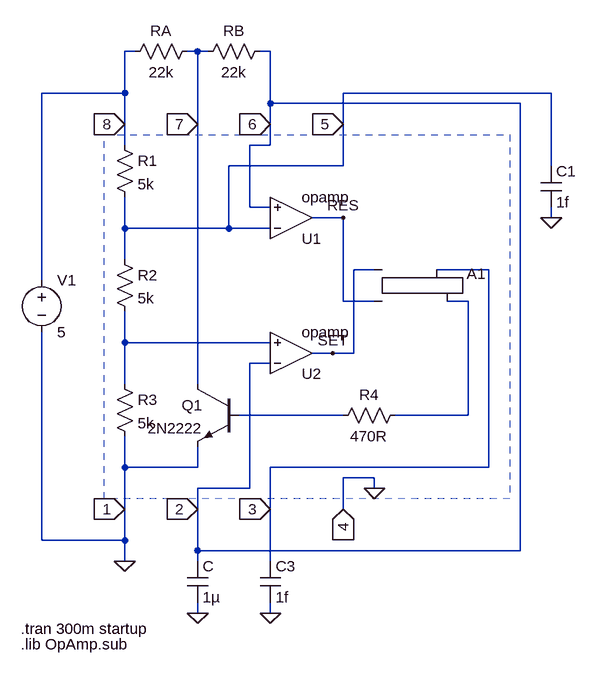
[diagram p0: schematic NE555 (elementos discretos).asc]
NE555 (elementos discretos).asc, the LTspice schematic file:
Version 4
SHEET 1 884 748
WIRE 16 -176 0 -176
WIRE 112 -176 96 -176
WIRE 128 -176 112 -176
WIRE 224 -176 208 -176
WIRE 0 -112 0 -176
WIRE 0 -112 -128 -112
WIRE 656 -112 336 -112
WIRE 224 -96 224 -176
WIRE 608 -96 224 -96
WIRE 0 -64 0 -112
WIRE 112 -64 112 -176
WIRE 224 -64 224 -96
WIRE 336 -64 336 -112
WIRE 0 -32 0 -64
WIRE 224 -32 224 -64
WIRE 224 -32 192 -32
WIRE 336 0 336 -64
WIRE 336 0 160 0
WIRE 656 0 656 -112
WIRE 192 64 192 -32
WIRE 224 64 192 64
WIRE 336 80 288 80
WIRE 656 80 656 64
WIRE 0 96 0 48
WIRE 160 96 160 0
WIRE 160 96 0 96
WIRE 224 96 160 96
WIRE 0 144 0 96
WIRE 384 160 352 160
WIRE 560 160 480 160
WIRE -128 176 -128 -112
WIRE 336 208 336 80
WIRE 384 208 336 208
WIRE 528 208 496 208
WIRE 0 272 0 224
WIRE 224 272 0 272
WIRE 320 288 288 288
WIRE 352 288 352 160
WIRE 352 288 320 288
WIRE 224 304 192 304
WIRE 0 336 0 272
WIRE 112 336 112 -64
WIRE 336 384 176 384
WIRE 528 384 528 208
WIRE 528 384 416 384
WIRE 0 464 0 416
WIRE 112 464 112 432
WIRE 112 464 0 464
WIRE 560 464 560 160
WIRE 560 464 224 464
WIRE 384 480 336 480
WIRE 192 496 192 304
WIRE 192 496 112 496
WIRE 384 496 384 480
WIRE 0 528 0 464
WIRE 112 528 112 496
WIRE 224 528 224 464
WIRE 336 528 336 480
WIRE -128 576 -128 256
WIRE 0 576 0 528
WIRE 0 576 -128 576
WIRE 112 592 112 528
WIRE 608 592 608 -96
WIRE 608 592 112 592
WIRE 0 608 0 576
WIRE 112 608 112 592
WIRE 224 608 224 528
WIRE 112 688 112 672
WIRE 224 688 224 672
FLAG 0 -64 8
IOPIN 0 -64 In
FLAG 112 -64 7
IOPIN 112 -64 In
FLAG 224 -64 6
IOPIN 224 -64 In
FLAG 336 -64 5
IOPIN 336 -64 In
FLAG 0 528 1
IOPIN 0 528 In
FLAG 112 528 2
IOPIN 112 528 In
FLAG 224 528 3
IOPIN 224 528 In
FLAG 336 528 4
IOPIN 336 528 In
FLAG 384 496 0
FLAG 656 80 0
FLAG 112 688 0
FLAG 0 608 0
FLAG 224 688 0
FLAG 336 80 RES
FLAG 320 288 SET
SYMBOL res -16 -48 R0
SYMATTR InstName R1
SYMATTR Value 5k
SYMBOL res -16 128 R0
SYMATTR InstName R2
SYMATTR Value 5k
SYMBOL res -16 320 R0
SYMATTR InstName R3
SYMATTR Value 5k
SYMBOL npn 176 336 M0
SYMATTR InstName Q1
SYMATTR Value 2N2222
SYMBOL res 432 368 R90
WINDOW 0 0 56 VBottom 2
WINDOW 3 32 56 VTop 2
SYMATTR InstName R4
SYMATTR Value 470R
SYMBOL voltage -128 160 R0
WINDOW 123 0 0 Left 0
WINDOW 39 0 0 Left 0
SYMATTR InstName V1
SYMATTR Value 5
SYMBOL cap 640 0 R0
SYMATTR InstName C1
SYMATTR Value 1f
SYMBOL cap 96 608 R0
SYMATTR InstName C
SYMATTR Value 1µ
SYMBOL res 224 -192 R90
WINDOW 0 0 56 VBottom 2
WINDOW 3 32 56 VTop 2
SYMATTR InstName RB
SYMATTR Value 22k
SYMBOL res 112 -192 R90
WINDOW 0 0 56 VBottom 2
WINDOW 3 32 56 VTop 2
SYMATTR InstName RA
SYMATTR Value 22k
SYMBOL cap 208 608 R0
SYMATTR InstName C3
SYMATTR Value 1f
SYMBOL Digital\\srflop 432 112 R0
SYMATTR InstName A1
SYMBOL Opamps\\opamp 256 144 M180
SYMATTR InstName U1
SYMBOL Opamps\\opamp 256 352 M180
SYMATTR InstName U2
TEXT -160 712 Left 2 !.tran 300m startup
TEXT -160 736 Left 2 !.lib OpAmp.sub
RECTANGLE Normal 592 512 -32 -48 2

The netlist it stands for:
* NE555 (elementos discretos).asc
R1 8 5 5k
R2 5 N002 5k
R3 N002 0 5k
Q1 7 N003 0 0 2N2222
R4 N001 N003 470R
V1 8 0 5
C1 5 0 1f
C 2 0 1µ
RB 2 7 22k
RA 7 8 22k
C3 3 0 1f
A1 SET RES 0 0 0 N001 3 0 SRFLOP
XU1 5 2 RES opamp Aol=100K GBW=10Meg  ; pins invin noninvin out
XU2 2 N002 SET opamp Aol=100K GBW=10Meg  ; pins invin noninvin out
.model NPN NPN
.model PNP PNP
.lib standard.bjt
.tran 300m startup
.lib OpAmp.sub
.backanno
.end